# Altium schematic sheet Sheet_1.schdoc
size 435 x 265 mm
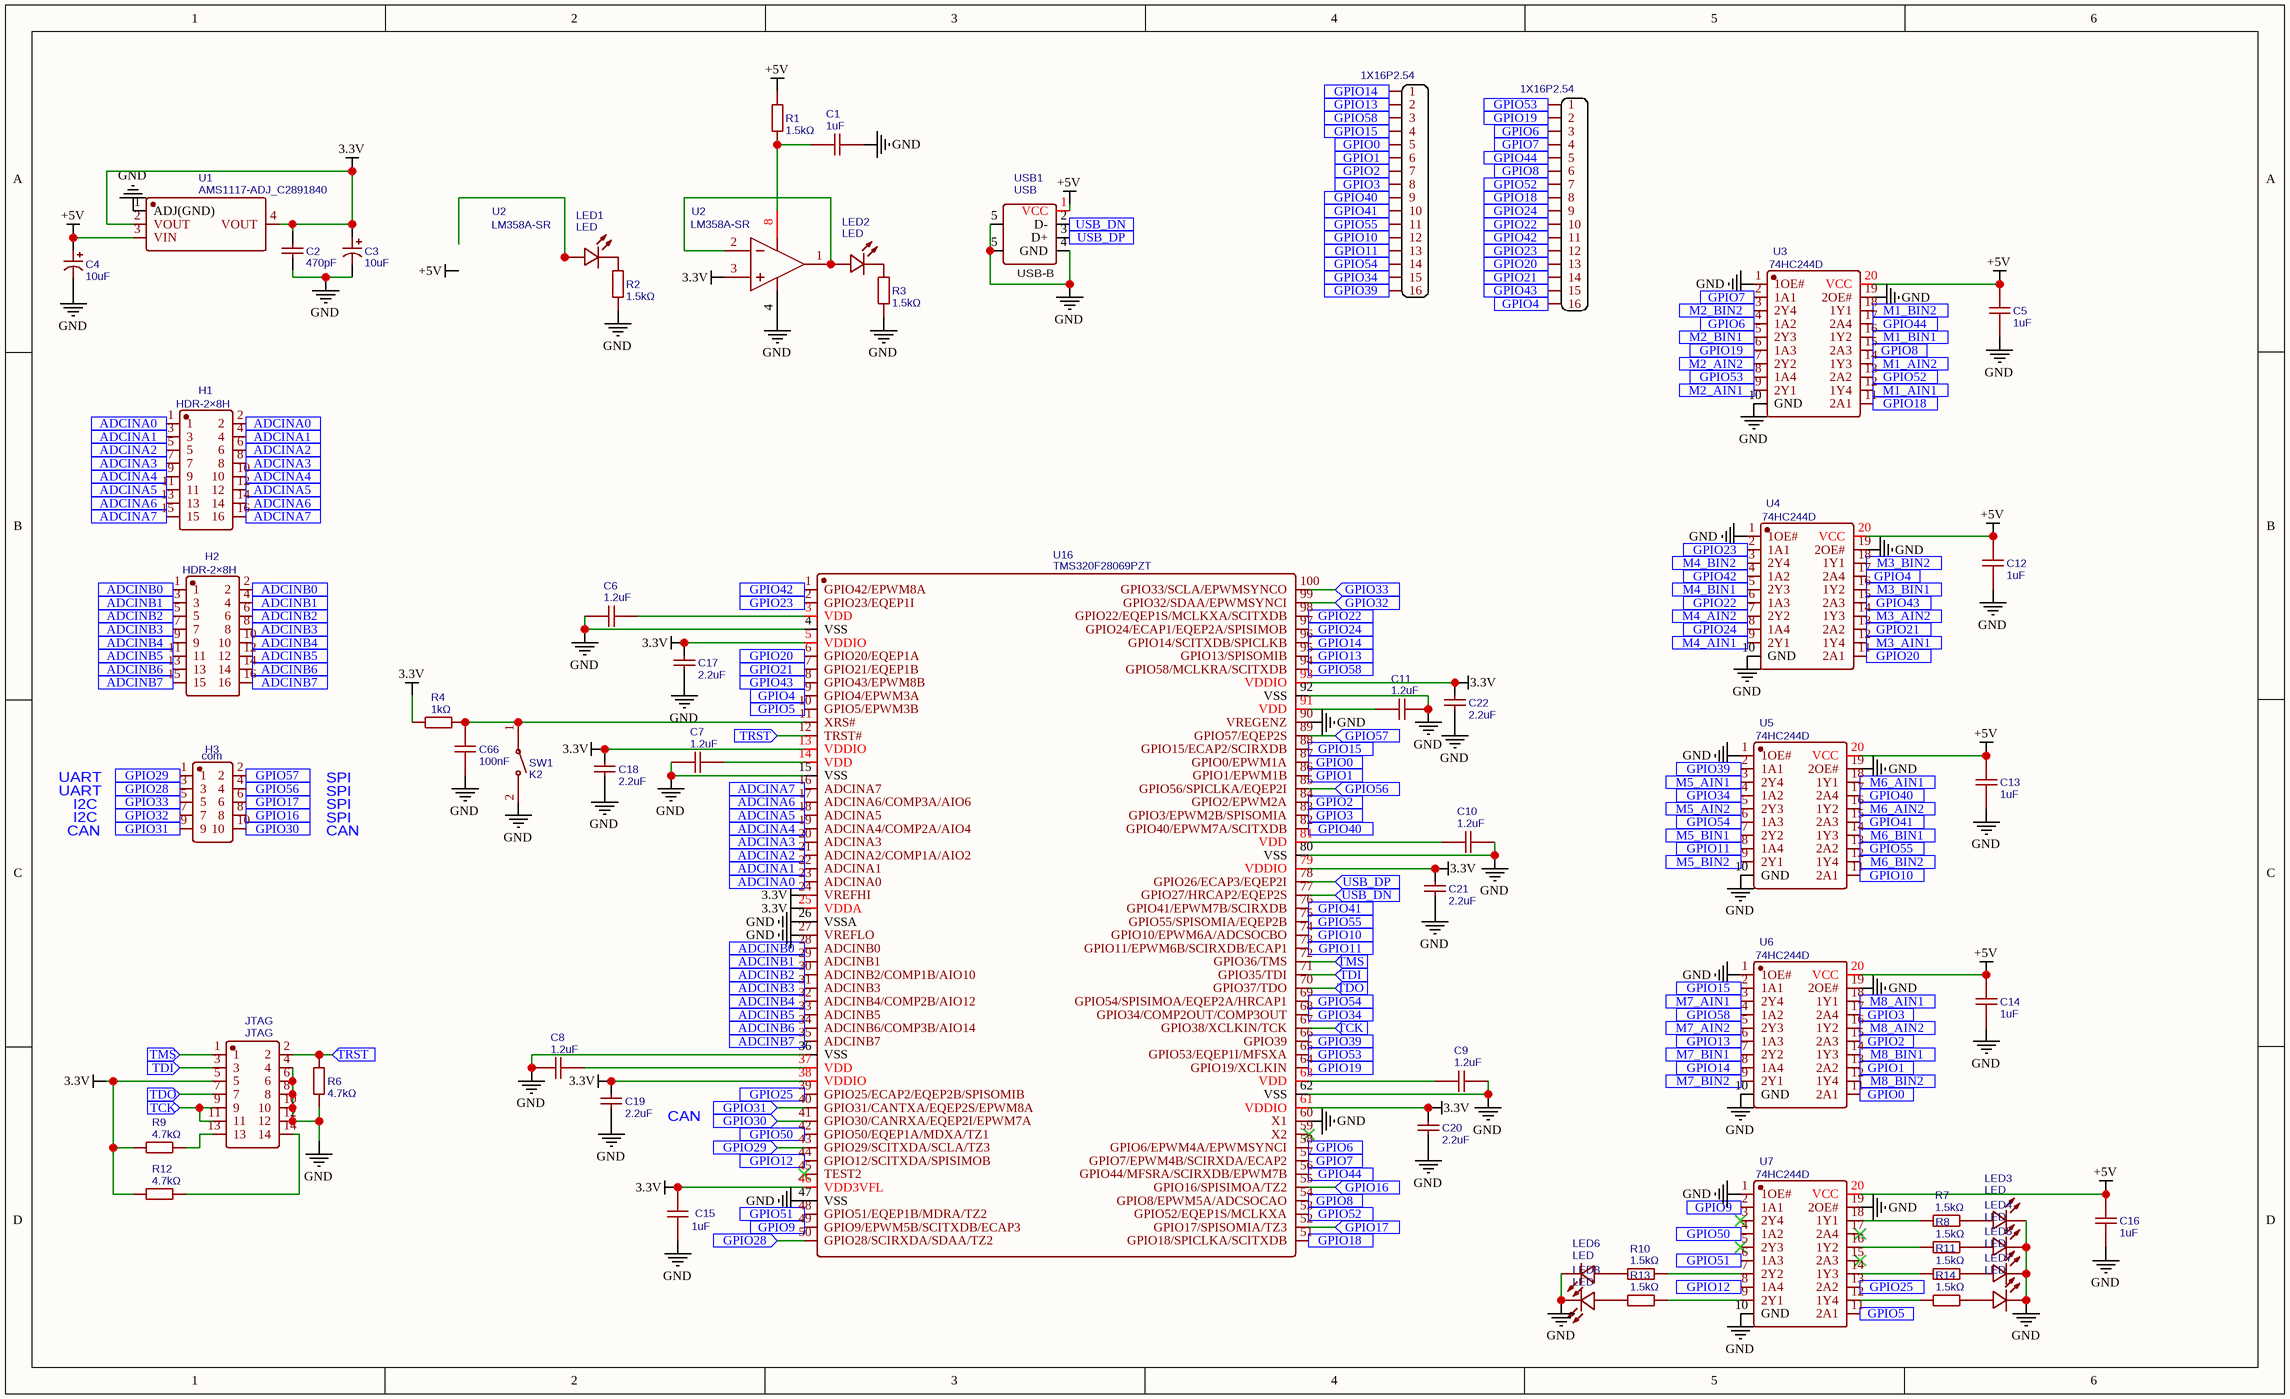
[diagram p0: Sheet_1.schdoc]

## Parts
(Parts that share a designator on the sheet are numbered #1, #2 ... from top to bottom, then left to right.)
C1  1uF  [C0805]
C2  470pF  [C0805]
C3  10uF  [CAP-SMD_BD4.0-L4.3-W4.3-FD-LS4.8]
C4  10uF  [CAP-SMD_BD4.0-L4.3-W4.3-FD-LS4.8]
C5  1uF  [C0805]
C6  1.2uF  [C0805]
C7  1.2uF  [C0805]
C8  1.2uF  [C0805]
C9  1.2uF  [C0805]
C10  1.2uF  [C0805]
C11  1.2uF  [C0805]
C12  1uF  [C0805]
C13  1uF  [C0805]
C14  1uF  [C0805]
C15  1uF  [C0805]
C16  1uF  [C0805]
C17  2.2uF  [C0805]
C18  2.2uF  [C0805]
C19  2.2uF  [C0805]
C20  2.2uF  [C0805]
C21  2.2uF  [C0805]
C22  2.2uF  [C0805]
C66  100nF  [C0805]
H1  HDR-2×8H  [HDR-TH_16P-P2.54-V-M-R2-C8-S2.54]
H2  HDR-2×8H  [HDR-TH_16P-P2.54-V-M-R2-C8-S2.54]
H3  com  [HDR-TH_10P-P2.54-V-F-R2-C5-S2.54-3]
JTAG  JTAG  [HDR-TH_14P-P2.54-V-F-R2-C7-S2.54]
LED1  LED  [LED0805-FD]
LED2  LED  [LED0805-FD]
LED3  LED  [LED0805-FD]
LED4  LED  [LED0805-FD]
LED5  LED  [LED0805-FD]
LED6  LED  [LED0805-FD]
LED7  LED  [LED0805-FD]
LED8  LED  [LED0805-FD]
NO  1X16P2.54  [1X16P2.54]
NO1  1X16P2.54  [1X16P2.54]
R1  1.5kΩ  [R0805]
R2  1.5kΩ  [R0805]
R3  1.5kΩ  [R0805]
R4  1kΩ  [R0805]
R6  4.7kΩ  [R0805]
R7  1.5kΩ  [R0805]
R8  1.5kΩ  [R0805]
R9  4.7kΩ  [R0805]
R10  1.5kΩ  [R0805]
R11  1.5kΩ  [R0805]
R12  4.7kΩ  [R0805]
R13  1.5kΩ  [R0805]
R14  1.5kΩ  [R0805]
SW1  K2  [KEY-SMD_L6.2-W3.6-LS8.0]
U1  AMS1117-ADJ_C2891840  [SOT-223-3_L6.5-W3.4-P2.30-LS7.0-BR]
U2#1  LM358A-SR  [SOIC-8_L5.0-W4.0-P1.27-LS6.0-BL]
U2#2  LM358A-SR  [SOIC-8_L5.0-W4.0-P1.27-LS6.0-BL]
U3  74HC244D  [SOIC-20_L13.0-W7.6-P1.27-LS10.3-BL]
U4  74HC244D  [SOIC-20_L13.0-W7.6-P1.27-LS10.3-BL]
U5  74HC244D  [SOIC-20_L13.0-W7.6-P1.27-LS10.3-BL]
U6  74HC244D  [SOIC-20_L13.0-W7.6-P1.27-LS10.3-BL]
U7  74HC244D  [SOIC-20_L13.0-W7.6-P1.27-LS10.3-BL]
U16  TMS320F28069PZT  [LQFP-100_L14.0-W14.0-P0.50-LS16.0-BL]
USB1  USB  [USB-B_TH_BF90]

## Ports
ADCINA0 (in), ADCINA1 (in), ADCINA2 (in), ADCINA3 (in), ADCINA4 (in), ADCINA5 (in), ADCINA6 (in), ADCINA7 (in), ADCINB0 (in), ADCINB1 (in), ADCINB2 (in), ADCINB3 (in), ADCINB4 (in), ADCINB5 (in), ADCINB6 (in), ADCINB7 (in), GPIO0 (in), GPIO1 (in), GPIO2 (in), GPIO3 (in), GPIO4 (in), GPIO5 (in), GPIO6 (in), GPIO7 (in), GPIO8 (in), GPIO9 (in), GPIO10 (in), GPIO11 (in), GPIO12 (in), GPIO13 (in), GPIO14 (in), GPIO15 (in), GPIO16 (in), GPIO17 (in), GPIO18 (in), GPIO19 (in), GPIO20 (in), GPIO21 (in), GPIO22 (in), GPIO23 (in), GPIO24 (in), GPIO25 (in), GPIO28 (in), GPIO29 (in), GPIO30 (in), GPIO31 (in), GPIO32 (in), GPIO33 (in), GPIO34 (in), GPIO39 (in), GPIO40 (in), GPIO41 (in), GPIO42 (in), GPIO43 (in), GPIO44 (in), GPIO50 (in), GPIO51 (in), GPIO52 (in), GPIO53 (in), GPIO54 (in), GPIO55 (in), GPIO56 (in), GPIO57 (in), GPIO58 (in), M1_AIN1 (in), M1_AIN2 (in), M1_BIN1 (in), M1_BIN2 (in), M2_AIN1 (in), M2_AIN2 (in), M2_BIN1 (in), M2_BIN2 (in), M3_AIN1 (in), M3_AIN2 (in), M3_BIN1 (in), M3_BIN2 (in), M4_AIN1 (in), M4_AIN2 (in), M4_BIN1 (in), M4_BIN2 (in), M5_AIN1 (in), M5_AIN2 (in), M5_BIN1 (in), M5_BIN2 (in), M6_AIN1 (in), M6_AIN2 (in), M6_BIN1 (in), M6_BIN2 (in), M7_AIN1 (in), M7_AIN2 (in), M7_BIN1 (in), M7_BIN2 (in), M8_AIN1 (in), M8_AIN2 (in), M8_BIN1 (in), M8_BIN2 (in), TCK (in), TDI (in), TDO (in), TMS (in), TRST (in), USB_DN (in), USB_DP (in)

## Nets
3.3V: C2.2 C3.1 C15.2 C17.2 C18.2 C19.2 C20.2 C21.2 C22.1 JTAG.5 R4.1 R9.1 R12.1 U1.2(VOUT) U1.4(VOUT) U2#2.3(INA+) U16.5(VDDIO) U16.13(VDDIO) U16.24(VREFHI) U16.25(VDDA) U16.38(VDDIO) U16.46(VDD3VFL) U16.61(VDDIO) U16.79(VDDIO) U16.93(VDDIO)
+5V: C4.1 C5.1 C12.1 C13.1 C14.1 C16.1 R1.1 U1.3(VIN) U3.20(VCC) U4.20(VCC) U5.20(VCC) U6.20(VCC) U7.20(VCC) USB1.1(VCC)
GND: C1.1 C2.1 C3.2 C4.2 C5.2 C6.1 C7.1 C8.1 C9.2 C10.2 C11.2 C12.2 C13.2 C14.2 C15.1 C16.2 C17.1 C18.1 C19.1 C20.1 C21.1 C22.2 C66.1 JTAG.4 JTAG.6 JTAG.8 JTAG.10 JTAG.12 LED3.2(K) LED4.2(K) LED5.2(K) LED6.2(K) LED7.2(K) LED8.2(K) R2.1 R3.1 R6.1 SW1.2 U1.1(ADJ(GND)) U2#2.4(-VS) U3.1(1OE#) U3.10(GND) U3.19(2OE#) U4.1(1OE#) U4.10(GND) U4.19(2OE#) U5.1(1OE#) U5.10(GND) U5.19(2OE#) U6.1(1OE#) U6.10(GND) U6.19(2OE#) U7.1(1OE#) U7.10(GND) U7.19(2OE#) U16.4(VSS) U16.15(VSS) U16.26(VSSA) U16.27(VREFLO) U16.36(VSS) U16.47(VSS) U16.60(X1) U16.62(VSS) U16.80(VSS) U16.90(VREGENZ) U16.92(VSS) USB1.4(GND) USB1.5
ADCINA0: H1.1 H1.2 U16.23(ADCINA0) ; port ADCINA0
ADCINA1: H1.3 H1.4 U16.22(ADCINA1) ; port ADCINA1
ADCINA2: H1.5 H1.6 U16.21(ADCINA2/COMP1A/AIO2) ; port ADCINA2
ADCINA3: H1.7 H1.8 U16.20(ADCINA3) ; port ADCINA3
ADCINA4: H1.9 H1.10 U16.19(ADCINA4/COMP2A/AIO4) ; port ADCINA4
ADCINA5: H1.11 H1.12 U16.18(ADCINA5) ; port ADCINA5
ADCINA6: H1.13 H1.14 U16.17(ADCINA6/COMP3A/AIO6) ; port ADCINA6
ADCINA7: H1.15 H1.16 U16.16(ADCINA7) ; port ADCINA7
ADCINB0: H2.1 H2.2 U16.28(ADCINB0) ; port ADCINB0
ADCINB1: H2.3 H2.4 U16.29(ADCINB1) ; port ADCINB1
ADCINB2: H2.5 H2.6 U16.30(ADCINB2/COMP1B/AIO10) ; port ADCINB2
ADCINB3: H2.7 H2.8 U16.31(ADCINB3) ; port ADCINB3
ADCINB4: H2.9 H2.10 U16.32(ADCINB4/COMP2B/AIO12) ; port ADCINB4
ADCINB5: H2.11 H2.12 U16.33(ADCINB5) ; port ADCINB5
ADCINB6: H2.13 H2.14 U16.34(ADCINB6/COMP3B/AIO14) ; port ADCINB6
ADCINB7: H2.15 H2.16 U16.35(ADCINB7) ; port ADCINB7
GPIO0: NO1.5 U6.11(2A1) U16.87(GPIO0/EPWM1A) ; port GPIO0
GPIO1: NO1.6 U6.13(2A2) U16.86(GPIO1/EPWM1B) ; port GPIO1
GPIO2: NO1.7 U6.15(2A3) U16.84(GPIO2/EPWM2A) ; port GPIO2
GPIO3: NO1.8 U6.17(2A4) U16.83(GPIO3/EPWM2B/SPISOMIA) ; port GPIO3
GPIO4: NO.16 U4.17(2A4) U16.9(GPIO4/EPWM3A) ; port GPIO4
GPIO5: U7.11(2A1) U16.10(GPIO5/EPWM3B) ; port GPIO5
GPIO6: NO.3 U3.4(1A2) U16.58(GPIO6/EPWM4A/EPWMSYNCI) ; port GPIO6
GPIO7: NO.4 U3.2(1A1) U16.57(GPIO7/EPWM4B/SCIRXDA/ECAP2) ; port GPIO7
GPIO8: NO.6 U3.15(2A3) U16.54(GPIO8/EPWM5A/ADCSOCAO) ; port GPIO8
GPIO9: U7.2(1A1) U16.49(GPIO9/EPWM5B/SCITXDB/ECAP3) ; port GPIO9
GPIO10: NO1.12 U5.11(2A1) U16.74(GPIO10/EPWM6A/ADCSOCBO) ; port GPIO10
GPIO11: NO1.13 U5.8(1A4) U16.73(GPIO11/EPWM6B/SCIRXDB/ECAP1) ; port GPIO11
GPIO12: U7.8(1A4) U16.44(GPIO12/SCITXDA/SPISIMOB) ; port GPIO12
GPIO13: NO1.2 U6.6(1A3) U16.95(GPIO13/SPISOMIB) ; port GPIO13
GPIO14: NO1.1 U6.8(1A4) U16.96(GPIO14/SCITXDB/SPICLKB) ; port GPIO14
GPIO15: NO1.4 U6.2(1A1) U16.88(GPIO15/ECAP2/SCIRXDB) ; port GPIO15
GPIO16: H3.8 U16.55(GPIO16/SPISIMOA/TZ2) ; port GPIO16
GPIO17: H3.6 U16.52(GPIO17/SPISOMIA/TZ3) ; port GPIO17
GPIO18: NO.8 U3.11(2A1) U16.51(GPIO18/SPICLKA/SCITXDB) ; port GPIO18
GPIO19: NO.2 U3.6(1A3) U16.64(GPIO19/XCLKIN) ; port GPIO19
GPIO20: NO.13 U4.11(2A1) U16.6(GPIO20/EQEP1A) ; port GPIO20
GPIO21: NO.14 U4.13(2A2) U16.7(GPIO21/EQEP1B) ; port GPIO21
GPIO22: NO.10 U4.6(1A3) U16.98(GPIO22/EQEP1S/MCLKXA/SCITXDB) ; port GPIO22
GPIO23: NO.12 U4.2(1A1) U16.2(GPIO23/EQEP1I) ; port GPIO23
GPIO24: NO.9 U4.8(1A4) U16.97(GPIO24/ECAP1/EQEP2A/SPISIMOB) ; port GPIO24
GPIO25: U7.13(2A2) U16.39(GPIO25/ECAP2/EQEP2B/SPISOMIB) ; port GPIO25
GPIO28: H3.3 U16.50(GPIO28/SCIRXDA/SDAA/TZ2) ; port GPIO28
GPIO29: H3.1 U16.43(GPIO29/SCITXDA/SCLA/TZ3) ; port GPIO29
GPIO30: H3.10 U16.41(GPIO30/CANRXA/EQEP2I/EPWM7A) ; port GPIO30
GPIO31: H3.9 U16.40(GPIO31/CANTXA/EQEP2S/EPWM8A) ; port GPIO31
GPIO32: H3.7 U16.99(GPIO32/SDAA/EPWMSYNCI) ; port GPIO32
GPIO33: H3.5 U16.100(GPIO33/SCLA/EPWMSYNCO) ; port GPIO33
GPIO34: NO1.15 U5.4(1A2) U16.68(GPIO34/COMP2OUT/COMP3OUT) ; port GPIO34
GPIO39: NO1.16 U5.2(1A1) U16.66(GPIO39) ; port GPIO39
GPIO40: NO1.9 U5.17(2A4) U16.82(GPIO40/EPWM7A/SCITXDB) ; port GPIO40
GPIO41: NO1.10 U5.15(2A3) U16.76(GPIO41/EPWM7B/SCIRXDB) ; port GPIO41
GPIO42: NO.11 U4.4(1A2) U16.1(GPIO42/EPWM8A) ; port GPIO42
GPIO43: NO.15 U4.15(2A3) U16.8(GPIO43/EPWM8B) ; port GPIO43
GPIO44: NO.5 U3.17(2A4) U16.56(GPIO44/MFSRA/SCIRXDB/EPWM7B) ; port GPIO44
GPIO50: U7.4(1A2) U16.42(GPIO50/EQEP1A/MDXA/TZ1) ; port GPIO50
GPIO51: U7.6(1A3) U16.48(GPIO51/EQEP1B/MDRA/TZ2) ; port GPIO51
GPIO52: NO.7 U3.13(2A2) U16.53(GPIO52/EQEP1S/MCLKXA) ; port GPIO52
GPIO53: NO.1 U3.8(1A4) U16.65(GPIO53/EQEP1I/MFSXA) ; port GPIO53
GPIO54: NO1.14 U5.6(1A3) U16.69(GPIO54/SPISIMOA/EQEP2A/HRCAP1) ; port GPIO54
GPIO55: NO1.11 U5.13(2A2) U16.75(GPIO55/SPISOMIA/EQEP2B) ; port GPIO55
GPIO56: H3.4 U16.85(GPIO56/SPICLKA/EQEP2I) ; port GPIO56
GPIO57: H3.2 U16.89(GPIO57/EQEP2S) ; port GPIO57
GPIO58: NO1.3 U6.4(1A2) U16.94(GPIO58/MCLKRA/SCITXDB) ; port GPIO58
M1_AIN1: U3.12(1Y4) ; port M1_AIN1
M1_AIN2: U3.14(1Y3) ; port M1_AIN2
M1_BIN1: U3.16(1Y2) ; port M1_BIN1
M1_BIN2: U3.18(1Y1) ; port M1_BIN2
M2_AIN1: U3.9(2Y1) ; port M2_AIN1
M2_AIN2: U3.7(2Y2) ; port M2_AIN2
M2_BIN1: U3.5(2Y3) ; port M2_BIN1
M2_BIN2: U3.3(2Y4) ; port M2_BIN2
M3_AIN1: U4.12(1Y4) ; port M3_AIN1
M3_AIN2: U4.14(1Y3) ; port M3_AIN2
M3_BIN1: U4.16(1Y2) ; port M3_BIN1
M3_BIN2: U4.18(1Y1) ; port M3_BIN2
M4_AIN1: U4.9(2Y1) ; port M4_AIN1
M4_AIN2: U4.7(2Y2) ; port M4_AIN2
M4_BIN1: U4.5(2Y3) ; port M4_BIN1
M4_BIN2: U4.3(2Y4) ; port M4_BIN2
M5_AIN1: U5.3(2Y4) ; port M5_AIN1
M5_AIN2: U5.5(2Y3) ; port M5_AIN2
M5_BIN1: U5.7(2Y2) ; port M5_BIN1
M5_BIN2: U5.9(2Y1) ; port M5_BIN2
M6_AIN1: U5.18(1Y1) ; port M6_AIN1
M6_AIN2: U5.16(1Y2) ; port M6_AIN2
M6_BIN1: U5.14(1Y3) ; port M6_BIN1
M6_BIN2: U5.12(1Y4) ; port M6_BIN2
M7_AIN1: U6.3(2Y4) ; port M7_AIN1
M7_AIN2: U6.5(2Y3) ; port M7_AIN2
M7_BIN1: U6.7(2Y2) ; port M7_BIN1
M7_BIN2: U6.9(2Y1) ; port M7_BIN2
M8_AIN1: U6.18(1Y1) ; port M8_AIN1
M8_AIN2: U6.16(1Y2) ; port M8_AIN2
M8_BIN1: U6.14(1Y3) ; port M8_BIN1
M8_BIN2: U6.12(1Y4) ; port M8_BIN2
TCK: JTAG.9 JTAG.11 U16.67(GPIO38/XCLKIN/TCK) ; port TCK
TDI: JTAG.3 U16.71(GPIO35/TDI) ; port TDI
TDO: JTAG.7 U16.70(GPIO37/TDO) ; port TDO
TMS: JTAG.1 U16.72(GPIO36/TMS) ; port TMS
TRST: JTAG.2 R6.2 U16.12(TRST#) ; port TRST
USB_DN: U16.77(GPIO27/HRCAP2/EQEP2S) USB1.2(D-) ; port USB_DN
USB_DP: U16.78(GPIO26/ECAP3/EQEP2I) USB1.3(D+) ; port USB_DP
NetC1_2: C1.2 R1.2 U2#2.8(+VS)
NetC6_2: C6.2 U16.3(VDD)
NetC7_2: C7.2 U16.14(VDD)
NetC8_2: C8.2 U16.37(VDD)
NetC9_1: C9.1 U16.63(VDD)
NetC10_1: C10.1 U16.81(VDD)
NetC11_1: C11.1 U16.91(VDD)
NetC66_2: C66.2 R4.2 SW1.1 U16.11(XRS#)
NetJTAG_13: JTAG.13 R9.2
NetJTAG_14: JTAG.14 R12.2
NetLED1_2: LED1.2(K) R2.2
NetLED2_1: LED2.1(A) U2#2.1(OUTA) U2#2.2(INA-)
NetLED2_2: LED2.2(K) R3.2
NetLED3_1: LED3.1(A) R7.1
NetLED4_1: LED4.1(A) R8.1
NetLED5_1: LED5.1(A) R11.1
NetLED6_1: LED6.1(A) R10.1
NetLED7_1: LED7.1(A) R14.1
NetLED8_1: LED8.1(A) R13.1
NetR7_2: R7.2 U7.18(1Y1)
NetR8_2: R8.2 U7.16(1Y2)
NetR10_2: R10.2 U7.7(2Y2)
NetR11_2: R11.2 U7.14(1Y3)
NetR13_2: R13.2 U7.9(2Y1)
NetR14_2: R14.2 U7.12(1Y4)

Not connected (* = marked no-connect by the designer): LED1 1(A); U7 3(2Y4)* 5(2Y3)* 15(2A3)* 17(2A4)*; U16 45(TEST2)* 59(X2)*

## Notes on the sheet
- UART
- I2C
- SPI
- CAN
- Labels drawn without touching a wire or pin: +5V
- (in symbol USB) USB-B

## Library data of the parts
C1 C5 C12-C16 = 1uF: BOM_Manufacturer: KEMET; BOM_Manufacturer Part: C0805C105K4RAC7800; nameAlias: Capacitance; Contributor: LCSC; BOM_Supplier: LCSC; BOM_Supplier Part: C141131; BOM_JLCPCB Part Class: Extended Part; spicePre: C; spiceSymbolName: C0805C105K4RAC7800
C2 = 470pF: BOM_Manufacturer: HEC; BOM_Manufacturer Part: C0805N471J501T; nameAlias: Capacitance; BOM_Supplier: LCSC; BOM_Supplier Part: C105933; BOM_JLCPCB Part Class: Extended Part; spicePre: C; spiceSymbolName: C0805N471J501T
C3 C4 = 10uF: BOM_Manufacturer: KNSCHA(科尼盛); BOM_Manufacturer Part: XT10UF35V90RV0070; nameAlias: Capacitance; Contributor: lcsc; BOM_Supplier: LCSC; BOM_Supplier Part: C2992602; spicePre: C; spiceSymbolName: XT10UF35V90RV0070
C6-C11 = 1.2uF: BOM_Manufacturer: KEMET(基美); BOM_Manufacturer Part: C0805C125K8PACTU; Contributor: LCSC; nameAlias: Capacitance; BOM_Supplier: LCSC; BOM_Supplier Part: C2178293; BOM_JLCPCB Part Class: Extended Part; spicePre: C; spiceSymbolName: C0805C125K8PACTU
C17-C22 = 2.2uF: BOM_Manufacturer: YAGEO; BOM_Manufacturer Part: CC0805KKX5R9BB225; nameAlias: Capacitance; Contributor: LCSC; BOM_Supplier: LCSC; BOM_Supplier Part: C326581; BOM_JLCPCB Part Class: Extended Part; spicePre: C; spiceSymbolName: CC0805KKX5R9BB225
C66 = 100nF: BOM_Manufacturer: KEMET; BOM_Manufacturer Part: C0805X104K5RACAUTO; nameAlias: Capacitance; Contributor: LCSC; BOM_Supplier: LCSC; BOM_Supplier Part: C141172; BOM_JLCPCB Part Class: Extended Part; spicePre: C; spiceSymbolName: C0805X104K5RACAUTO
H1 H2 = HDR-2×8H: BOM_Manufacturer: XKB Connectivity; BOM_Manufacturer Part: X6521WV-2×08H-C30D60; Contributor: LCSC; BOM_Supplier: LCSC; BOM_Supplier Part: C706898; BOM_JLCPCB Part Class: Extended Part; spicePre: H; spiceSymbolName: X6521WV-2×08H-C30D60 COPY
H3 = com: BOM_Manufacturer: XKB Connectivity(中国星坤); BOM_Manufacturer Part: X5521FV-2X05-C30D743-0743; Contributor: LCSC; BOM_Supplier: LCSC; BOM_Supplier Part: C2764578; BOM_JLCPCB Part Class: Extended Part; spicePre: H; spiceSymbolName: X5521FV-2X05-C30D743-0743
JTAG = JTAG: BOM_Manufacturer: XKB Connectivity; BOM_Manufacturer Part: X6521FV-2×07-C85D32; Contributor: LCSC; BOM_Supplier: LCSC; BOM_Supplier Part: C718229; BOM_JLCPCB Part Class: Extended Part; spicePre: H; spiceSymbolName: X6521FV-2×07-C85D32
LED1-LED8 = LED: BOM_Manufacturer: KENTO; BOM_Manufacturer Part: whiteLEDSMD; BOM_Supplier: LCSC; BOM_Supplier Part: C34499; BOM_JLCPCB Part Class: Basic Part; spicePre: L; spiceSymbolName: whiteLEDSMD
NO NO1 = 1X16P2.54: Contributor: Thijs Koppen; BOM_Pins: 16; spicePre: H; spiceSymbolName: 1X16P2.54
R1-R3 R7 R8 R10 R11 R13 R14 = 1.5kΩ: BOM_Manufacturer: Ever Ohms Tech; BOM_Manufacturer Part: QR0805J1K5P05; Resistance (Ohms): 1.5K; nameAlias: Resistance; Contributor: LCSC; BOM_Supplier: LCSC; BOM_Supplier Part: C176211; BOM_JLCPCB Part Class: Extended Part; spicePre: R; spiceSymbolName: QR0805J1K5P05
R4 = 1kΩ: BOM_Manufacturer: LIZ Elec; BOM_Manufacturer Part: CR0805J80102G; Resistance (Ohms): 1K; nameAlias: Resistance; Contributor: LCSC; BOM_Supplier: LCSC; BOM_Supplier Part: C101925; BOM_JLCPCB Part Class: Extended Part; spicePre: R; spiceSymbolName: CR0805J80102G
R6 R9 R12 = 4.7kΩ: BOM_Manufacturer: Ever Ohms Tech; BOM_Manufacturer Part: QR0805J4K7P05; Resistance (Ohms): 4.7K; nameAlias: Resistance; Contributor: LCSC; BOM_Supplier: LCSC; BOM_Supplier Part: C149883; BOM_JLCPCB Part Class: Extended Part; spicePre: R; spiceSymbolName: QR0805J4K7P05
SW1 = K2: BOM_Manufacturer: Rectangular Connectors - Contacts; BOM_Manufacturer Part: K2-1107ST-A4SW-06; Contributor: LCSC; BOM_Supplier: LCSC; BOM_Supplier Part: C118141; BOM_JLCPCB Part Class: Extended Part; spicePre: S; spiceSymbolName: K2-1107ST-A4SW-06
U1 = AMS1117-ADJ_C2891840: BOM_Manufacturer: YONGYUTAI(永裕泰); Contributor: LCSC; BOM_Supplier: LCSC; BOM_Supplier Part: C2891840; BOM_Manufacturer Part: AMS1117-ADJ; BOM_JLCPCB Part Class: Extended Part; spicePre: U; spiceSymbolName: AMS1117-ADJ_C2891840
U2#1 U2#2 = LM358A-SR: BOM_Manufacturer: 3PEAK; subpart_no: 1; Contributor: LCSC; BOM_Supplier: LCSC; BOM_Supplier Part: C415708; BOM_Manufacturer Part: LM358A-SR; BOM_JLCPCB Part Class: Extended Part; spicePre: U; spiceSymbolName: LM358A-SR
U3-U7 = 74HC244D: BOM_Manufacturer: TI(德州仪器); BOM_Manufacturer Part: SN74HC244DW; Contributor: LCSC; BOM_Supplier: LCSC; BOM_Supplier Part: C1548087; spicePre: U; spiceSymbolName: SN74HC244DW
U16 = TMS320F28069PZT: BOM_Manufacturer: TI; Contributor: LCSC; BOM_Supplier: LCSC; BOM_Manufacturer Part: TMS320F28069PZT; BOM_Supplier Part: C82775; BOM_JLCPCB Part Class: Extended Part; spicePre: U; spiceSymbolName: TMS320F28069PZT
USB1 = USB: BOM_Manufacturer: TE Connectivity; BOM_Manufacturer Part: 292304-2; Contributor: LCSC; BOM_Supplier: LCSC; BOM_Supplier Part: C305923; BOM_JLCPCB Part Class: Extended Part; spicePre: U; spiceSymbolName: 292304-2